# EAGLE design Meshtastic-DIY (EAGLE 9.6.2)
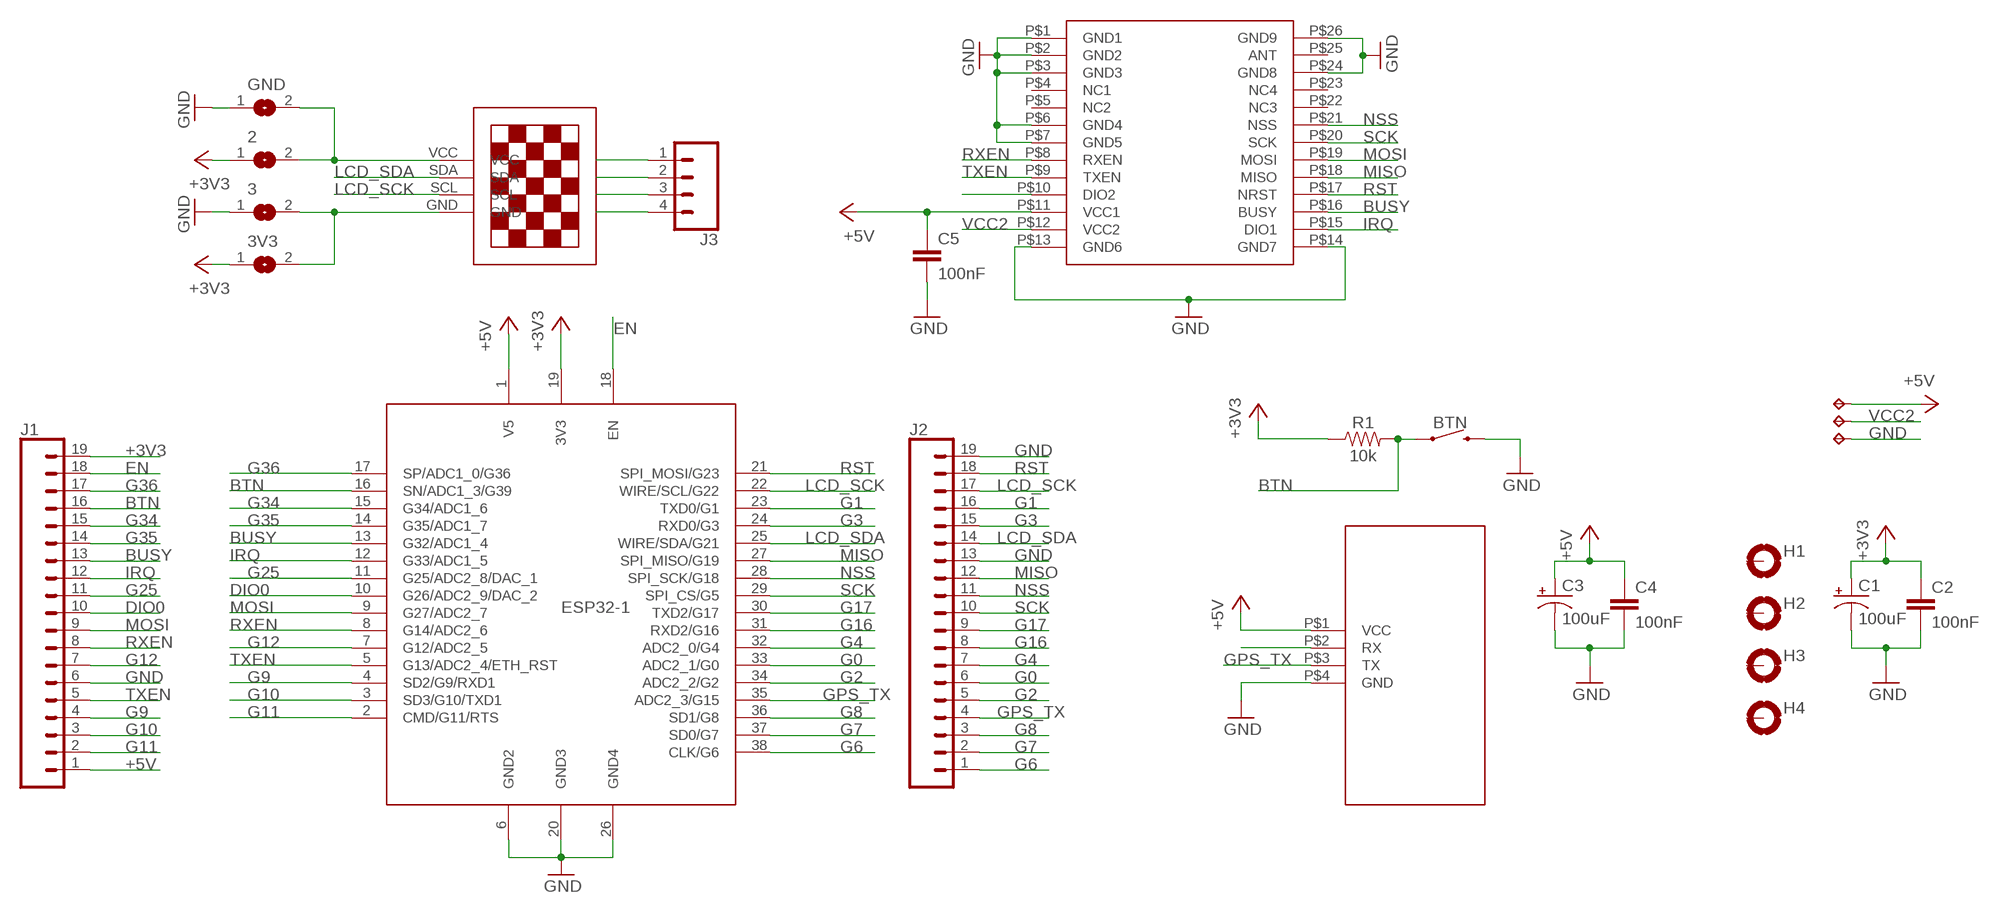
[diagram p0: schematic, sheet 1]

## Parts
2  SJ  [SJ]
3  SJ  [SJ]
3V3  SJ  [SJ]
BTN  MOMENTARY-SWITCH-SPST-PTH-6.0MM  [TACTILE_SWITCH_PTH_6.0MM]
C1  100uF  100UF-POLAR-EIA7343-10V-10%(TANT)  [EIA7343]
C2  100nF  0.33UF/330NF-0805-50V-10%  [0805]
C3  100uF  100UF-POLAR-EIA7343-10V-10%(TANT)  [EIA7343]
C4  100nF  0.33UF/330NF-0805-50V-10%  [0805]
C5  100nF  0.33UF/330NF-0805-50V-10%  [0805]
ESP32-1  NODEMCU_ESP32_WROOM_32  [NODEMCU_ESP32_WROOM_32--38PINS]
GND  SJ  [SJ]
H1  MOUNT-PAD-ROUND3.2  [3,2-PAD]
H2  MOUNT-PAD-ROUND3.2  [3,2-PAD]
H3  MOUNT-PAD-ROUND3.2  [3,2-PAD]
H4  MOUNT-PAD-ROUND3.2  [3,2-PAD]
J1  CONN_191X19_NO_SILK  [1X19_NO_SILK]
J2  CONN_191X19_NO_SILK  [1X19_NO_SILK]
J3  CONN_041X04_NO_SILK  [1X04_NO_SILK]
R1  10k  0.1OHM-1210-1/2W-1%  [1210]
TP1  TPTP14SQ  [TP14SQ]
TP2  TPTP14SQ  [TP14SQ]
TP3  TPTP14SQ  [TP14SQ]
U$1  13"OLED13"OLED  [1.3"OLED]
U$2  E22-XXXMXXS  [E22-XXXMXXS]
U$3  GPS-NEO  [GPS-NEO]

## Nets
+3V3: 2.1 3V3.1 C1.A(+) C2.1 ESP32-1.19(3V3) J1.19 R1.1
+5V: C3.A(+) C4.1 C5.1 ESP32-1.1(V5) J1.1 TP1.TP U$2.P$11(VCC1) U$3.P$1(VCC)
BTN: BTN.1 ESP32-1.16(SN/ADC1_3/G39) J1.16 R1.2
BUSY: ESP32-1.13(G32/ADC1_4) J1.13 U$2.P$16(BUSY)
DIO0: ESP32-1.10(G26/ADC2_9/DAC_2) J1.10
EN: ESP32-1.18(EN) J1.18
G0: ESP32-1.33(ADC2_1/G0) J2.6
G1: ESP32-1.23(TXD0/G1) J2.16
G2: ESP32-1.34(ADC2_2/G2) J2.5
G3: ESP32-1.24(RXD0/G3) J2.15
G4: ESP32-1.32(ADC2_0/G4) J2.7
G6: ESP32-1.38(CLK/G6) J2.1
G7: ESP32-1.37(SD0/G7) J2.2
G8: ESP32-1.36(SD1/G8) J2.3
G9: ESP32-1.4(SD2/G9/RXD1) J1.4
G10: ESP32-1.3(SD3/G10/TXD1) J1.3
G11: ESP32-1.2(CMD/G11/RTS) J1.2
G12: ESP32-1.7(G12/ADC2_5) J1.7
G16: ESP32-1.31(RXD2/G16) J2.8
G17: ESP32-1.30(TXD2/G17) J2.9
G25: ESP32-1.11(G25/ADC2_8/DAC_1) J1.11
G34: ESP32-1.15(G34/ADC1_6) J1.15
G35: ESP32-1.14(G35/ADC1_7) J1.14
G36: ESP32-1.17(SP/ADC1_0/G36) J1.17
GND: 3.1 BTN.3 C1.C(-) C2.2 C3.C(-) C4.2 C5.2 ESP32-1.6(GND2) ESP32-1.20(GND3) ESP32-1.26(GND4) GND.1 J1.6 J2.13 J2.19 TP3.TP U$2.P$1(GND1) U$2.P$2(GND2) U$2.P$3(GND3) U$2.P$6(GND4) U$2.P$7(GND5) U$2.P$13(GND6) U$2.P$14(GND7) U$2.P$24(GND8) U$2.P$26(GND9) U$3.P$4(GND)
GPS_TX: ESP32-1.35(ADC2_3/G15) J2.4 U$3.P$3(TX)
IRQ: ESP32-1.12(G33/ADC1_5) J1.12 U$2.P$15(DIO1)
LCD_SCK: ESP32-1.22(WIRE/SCL/G22) J2.17 J3.3 U$1.SCL
LCD_SDA: ESP32-1.25(WIRE/SDA/G21) J2.14 J3.4 U$1.SDA
MISO: ESP32-1.27(SPI_MISO/G19) J2.12 U$2.P$18(MISO)
MOSI: ESP32-1.9(G27/ADC2_7) J1.9 U$2.P$19(MOSI)
N$1: U$2.P$10(DIO2)
N$2: 3.2 3V3.2 J3.2 U$1.GND
N$3: U$3.P$2(RX)
N$4: 2.2 GND.2 J3.1 U$1.VCC
NSS: ESP32-1.28(SPI_SCK/G18) J2.11 U$2.P$21(NSS)
RST: ESP32-1.21(SPI_MOSI/G23) J2.18 U$2.P$17(NRST)
RXEN: ESP32-1.8(G14/ADC2_6) J1.8 U$2.P$8(RXEN)
SCK: ESP32-1.29(SPI_CS/G5) J2.10 U$2.P$20(SCK)
TXEN: ESP32-1.5(G13/ADC2_4/ETH_RST) J1.5 U$2.P$9(TXEN)
VCC2: TP2.TP U$2.P$12(VCC2)
Unconnected: H1.B3,2(MOUNT) H2.B3,2(MOUNT) H3.B3,2(MOUNT) H4.B3,2(MOUNT) U$2.P$4(NC1) U$2.P$5(NC2) U$2.P$22(NC3) U$2.P$23(NC4) U$2.P$25(ANT)

## Library data of the parts
2 3 3V3 GND = jumper:SJ: SMD solder JUMPER
BTN = SparkFun-Switches:MOMENTARY-SWITCH-SPST: Momentary Switch (Pushbutton) - SPST Normally-open (NO) SPST momentary switches (buttons, pushbuttons). Variants PTH-12MM - 12mm square, through-hole Momentary Pushbutton Switch - 12mm Square <https://www.sparkfun.com/products/9190> (COM-09190) PTH-6.0MM, PTH-6.0MM-KIT - 6.0mm square, through-hole Mini Pushbutton Switch <https://www.sparkfun.com/products/97> (COM-00097) KIT package intended for soldering kit's - only one side of pads' copper is exposed. PTH-RIGHT-ANGLE-KIT - Right-angle, through-hole Right Angle Tactile Button <https://www.sparkfun.com/products/10791> - Used on SparkFun BigTime Watch Kit <https://www.sparkfun.com/products/11734> SMD-12MM - 12mm square, surface-mount Tactile Button - SMD (12mm) <https://www.sparkfun.com/products/12993> (COM-12993) Used on SparkFun PicoBoard <https://www.sparkfun.com/products/11888> SMD-4.5MM - 4.5mm Square Trackball Switch Used on SparkFun Blackberry Trackballer Breakout <https://www.sparkfun.com/products/13169> SMD-4.6MMX2.8MM - 4.60mm x 2.80mm, surface mount Used on SparkFun SAMD21 Mini Breakout <https://www.sparkfun.com/products/13664> SMD-5.2MM, SMD-5.2-REDUNDANT - 5.2mm square, surface-mount Mini Pushbutton Switch - SMD <https://www.sparkfun.com/products/8720> (COM-08720) Used on Arduino Pro Mini <https://www.sparkfun.com/products/11114> REDUNDANT package connects both switch circuits together SMD-6.0X3.5MM - 6.0 x 3.5mm, surface mount Momentary Reset Switch SMD <https://www.sparkfun.com/products/8229> (COM-08229) SMD-6.2MM-TALL - 6.2mm square, surface mount Tactile Button - SMD (6mm) <https://www.sparkfun.com/products/12992> Used on SparkFun Digital Sandbox <https://www.sparkfun.com/products/12651> SMD-RIGHT-ANGLE - Right-angle, surface mount Used on SparkFun Block for Intel® Edison - Arduino <https://www.sparkfun.com/products/13036>; PROD_ID: SWCH-08441; SF_SKU: COM-00097
C1 C3 = SparkFun-Capacitors:100UF-POLAR: 100µF polarized capacitors A capacitor is a passive two-terminal electrical component used to store electrical energy temporarily in an electric field.; PROD_ID: CAP-07890
C2 C4 C5 = SparkFun-Capacitors:0.33UF/330NF: 0.33µF/330nF ceramic capacitors A capacitor is a passive two-terminal electrical component used to store electrical energy temporarily in an electric field.; PROD_ID: CAP-08469; VALUE: 0.33µF
ESP32-1 = ESP32 NODEMCU WROOM 32:NODEMCU_ESP32_WROOM_32: NODEMCU ESP32 WROOM 32 38 Pins PINOUT: https://cdn.shopify.com/s/files/1/1509/1638/files/ESP_-_32_NodeMCU_Developmentboard_Pinout_Diagram.jpg?4479111012146266271; ESP: ESP32 WROOM 32
H1-H4 = holes:MOUNT-PAD-ROUND: MOUNTING PAD, round
J1 J2 = SparkFun-SEWPAD16:CONN_19: Multi connection point. Often used as Generic Header-pin footprint for 0.1 inch spaced/style header connections On any of the 0.1 inch spaced packages, you can populate with these: Break Away Headers - Straight <https://www.sparkfun.com/products/116> (PRT-00116) Break Away Male Headers - Right Angle <https://www.sparkfun.com/products/553> (PRT-00553) Female Headers <https://www.sparkfun.com/products/115> (PRT-00115) Break Away Headers - Machine Pin <https://www.sparkfun.com/products/117> (PRT-00117) Break Away Female Headers - Swiss Machine Pin <https://www.sparkfun.com/products/743> (PRT-00743) For SCREWTERMINALS and SPRING TERMINALS visit here: Screw Terimnals on SparkFun.com <https://www.sparkfun.com/search/results?term=Screw+Terminals> (5mm/3.5mm/2.54mm spacing) This device is also useful as a general connection point to wire up your design to another part of your project. Our various solder wires solder well into these plated through hole pads. Hook-Up Wire - Assortment (Stranded, 22 AWG) <https://www.sparkfun.com/products/11375> (PRT-11375) Hook-Up Wire - Assortment (Solid Core, 22 AWG) <https://www.sparkfun.com/products/11367> (PRT-11367) View the entire wire category on our website here <https://www.sparkfun.com/categories/141> Special notes: Molex polarized connector foot print use with SKU : PRT-08231 with associated crimp pins and housings. 1MM SMD Version SKU: PRT-10208 NOTES ON THE VARIANTS LOCK and LOCK_LONGPADS... This footprint was designed to help hold the alignment of a through-hole component (i.e. 6-pin header) while soldering it into place. You may notice that each hole has been shifted either up or down by 0.005 of an inch from it's more standard position (which is a perfectly straight line). This slight alteration caused the pins (the squares in the middle) to touch the edges of the holes. Because they are alternating, it causes a "brace" to hold the component in place. 0.005 has proven to be the perfect amount of "off-center" position when using our standard breakaway headers. Although looks a little odd when you look at the bare footprint, once you have a header in there, the alteration is very hard to notice. Also,if you push a header all the way into place, it is covered up entirely on the bottom side.
J3 = SparkFun-Connectors:CONN_04: Multi connection point. Often used as Generic Header-pin footprint for 0.1 inch spaced/style header connections On any of the 0.1 inch spaced packages, you can populate with these: Break Away Headers - Straight <https://www.sparkfun.com/products/116> (PRT-00116) Break Away Male Headers - Right Angle <https://www.sparkfun.com/products/553> (PRT-00553) Female Headers <https://www.sparkfun.com/products/115> (PRT-00115) Break Away Headers - Machine Pin <https://www.sparkfun.com/products/117> (PRT-00117) Break Away Female Headers - Swiss Machine Pin <https://www.sparkfun.com/products/743> (PRT-00743) For SCREWTERMINALS and SPRING TERMINALS visit here: Screw Terimnals on SparkFun.com <https://www.sparkfun.com/search/results?term=Screw+Terminals> (5mm/3.5mm/2.54mm spacing) This device is also useful as a general connection point to wire up your design to another part of your project. Our various solder wires solder well into these plated through hole pads. Hook-Up Wire - Assortment (Stranded, 22 AWG) <https://www.sparkfun.com/products/11375> (PRT-11375) Hook-Up Wire - Assortment (Solid Core, 22 AWG) <https://www.sparkfun.com/products/11367> (PRT-11367) View the entire wire category on our website here <https://www.sparkfun.com/categories/141> Special notes: Molex polarized connector foot print use with SKU : PRT-08231 with associated crimp pins and housings. 1MM SMD Version SKU: PRT-10208; PROD_ID: CONN-09696
R1 = SparkFun-Resistors:0.1OHM: 0.1Ω resistor A resistor is a passive two-terminal electrical component that implements electrical resistance as a circuit element. Resistors act to reduce current flow, and, at the same time, act to lower voltage levels within circuits. - Wikipedia; PROD_ID: RES-12374; VALUE: 0.1
TP1-TP3 = testpad:TP: Test pad
U$1 = 13oled:13"OLED
U$2 = E22-XXXMXXS:E22-XXXMXXS
U$3 = 13oled:GPS-NEO

## Board
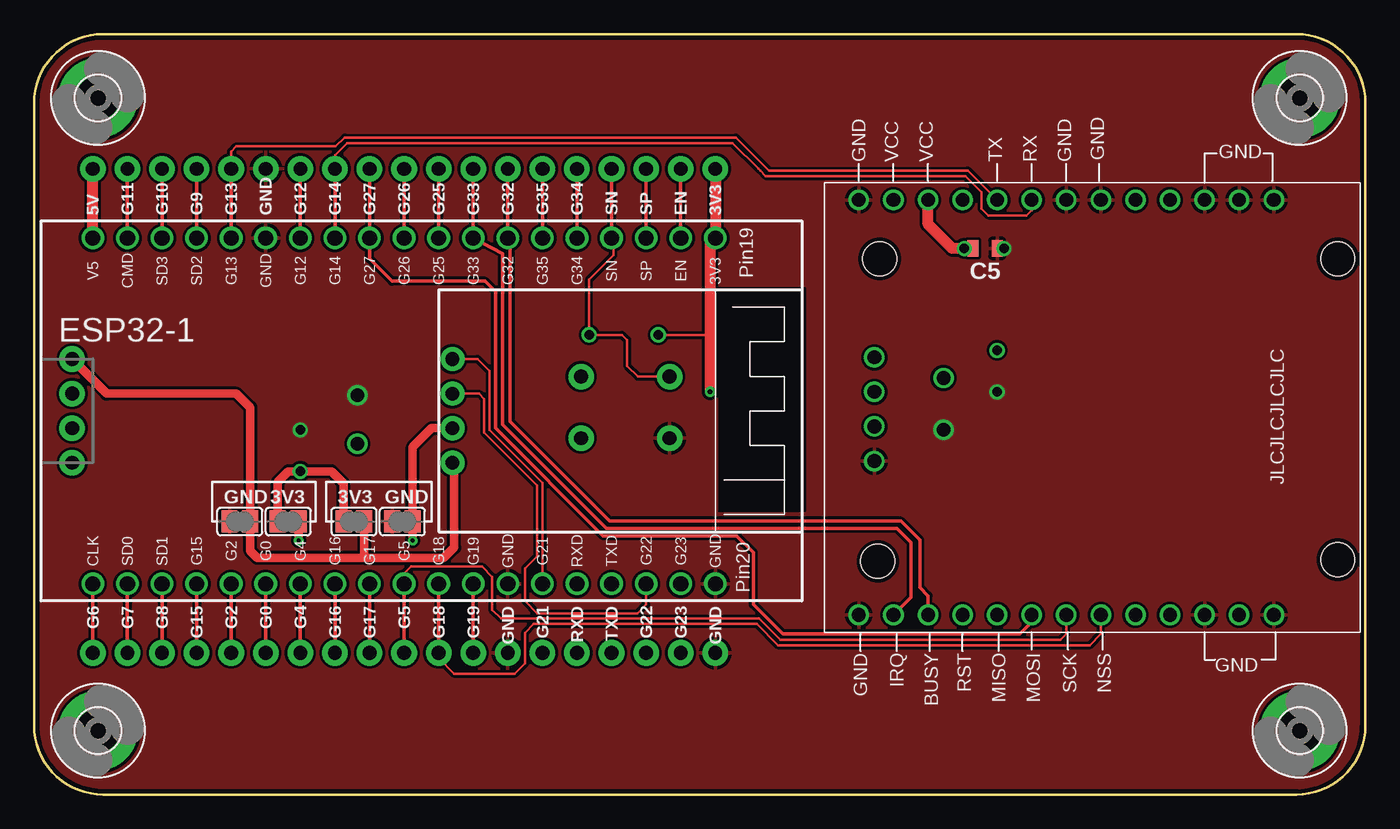
[diagram p1: board, top side]
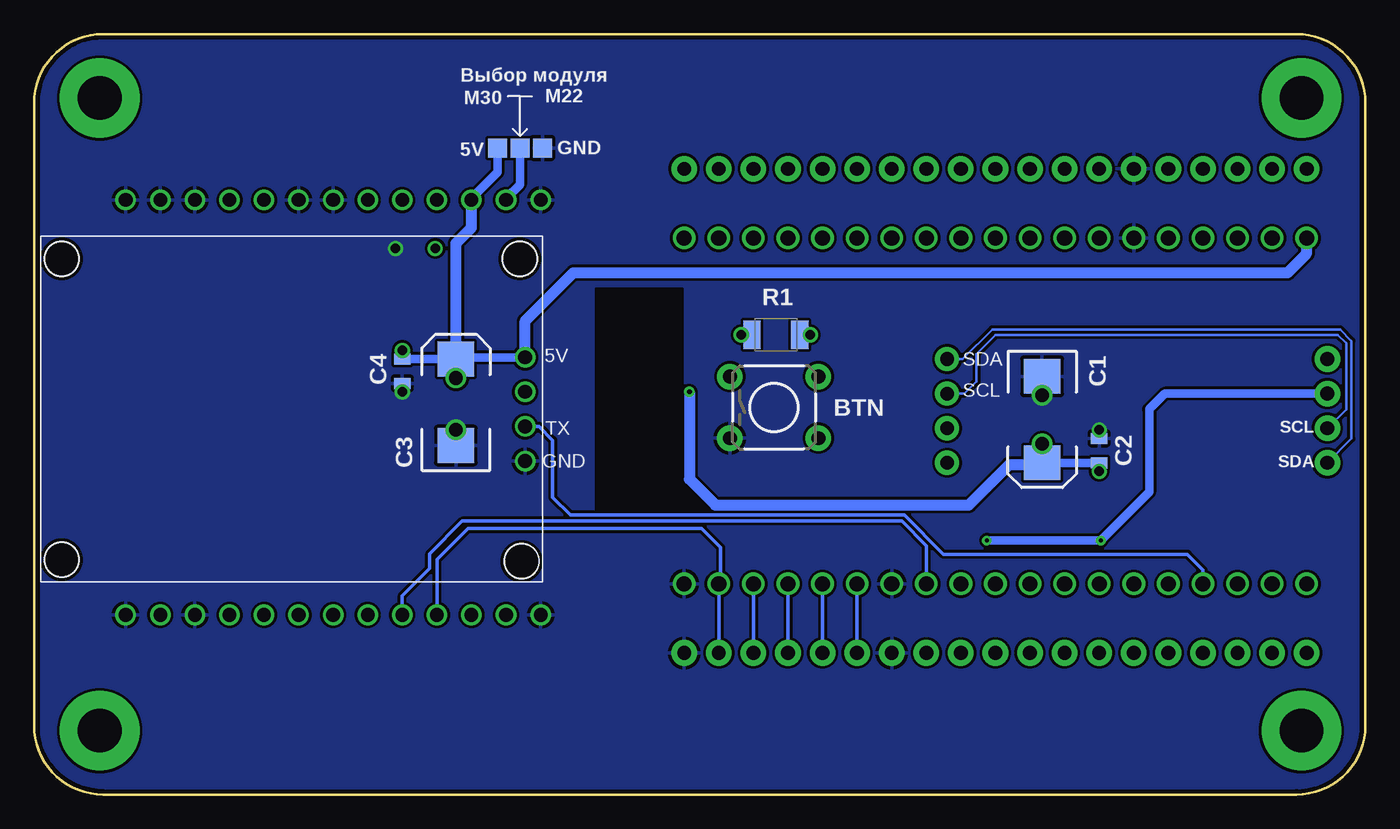
[diagram p2: board, bottom side, seen from below]

Size 97.79 x 55.88 mm. Coordinates in mm from the lower left corner, seen from the top.
Outline: 97.79,5.08 97.79,50.8 arc90 92.71,55.88 5.08,55.88 arc90 0,50.8 0,5.08 arc90 5.08,0 92.71,0 arc90 97.79,5.08
Outline: 97.79,5.08 97.79,4.7
Copper layers (1*16): Top 0.035mm / dielectric 1.5mm / Bottom 0.035mm
Design rules "default *": minimum track width 0.2mm, minimum drill 0.25mm, track to track 0.2mm, track to pad 0.2mm, pad to pad 0.2mm, via to via 0.2mm, smd to smd 6mil, copper to edge 0.3mm, drill to drill 0.3mm, minimum pad ring 10mil, minimum via ring 8mil, stop-mask expansion 2mil, vias tented up to drill 0.35mm, thermal gap 10mil
Holes 2.5 mm at 62.1,39.37 61.98,17.14 95.76,39.37 95.76,17.27
tRestrict: area 50.3,20.8 to 56.6,37.2
bRestrict: area 50.2,20.8 to 56.5,37.2

### Footprints (pad centres in the part's own frame; a part is rotated, then mirrored left to right if it is on the bottom)
SJ = smd 1.168 x 1.6: 1 -0.762,0; 2 0.762,0
TACTILE_SWITCH_PTH_6.0MM = drill 1.016 pad 1.88: 1 -3.251,2.261; 2 3.251,2.261; 3 -3.251,-2.261; 4 3.251,-2.261
EIA7343 = smd 2.55 x 2.7: A 3.17,0; C -3.17,0
0805 = smd 0.8 x 1.2: 1 -0.9,0; 2 0.9,0
NODEMCU_ESP32_WROOM_32--38PINS = drill 1.11 pad 1.6: 1 -12.7,-24.13; 2 -12.7,-21.59; 3 -12.7,-19.05; 4 -12.7,-16.51; 5 -12.7,-13.97; 6 -12.7,-11.43; 7 -12.7,-8.89; 8 -12.7,-6.35; 9 -12.7,-3.81; 10 -12.7,-1.27; 11 -12.7,1.27; 12 -12.7,3.81; 13 -12.7,6.35; 14 -12.7,8.89; 15 -12.7,11.43; 16 -12.7,13.97; 17 -12.7,16.51; 18 -12.7,19.05; 19 -12.7,21.59; 20 12.7,21.59; 21 12.7,19.05; 22 12.7,16.51; 23 12.7,13.97; 24 12.7,11.43; 25 12.7,8.89; 26 12.7,6.35; 27 12.7,3.81; 28 12.7,1.27; 29 12.7,-1.27; 30 12.7,-3.81; 31 12.7,-6.35; 32 12.7,-8.89; 33 12.7,-11.43; 34 12.7,-13.97; 35 12.7,-16.51; 36 12.7,-19.05; 37 12.7,-21.59; 38 12.7,-24.13
3,2-PAD = drill 3.2 pad 5.842: B3,2 0,0
1X19_NO_SILK = drill 1.016 pad 1.88: 1 0,0; 2 2.54,0; 3 5.08,0; 4 7.62,0; 5 10.16,0; 6 12.7,0; 7 15.24,0; 8 17.78,0; 9 20.32,0; 10 22.86,0; 11 25.4,0; 12 27.94,0; 13 30.48,0; 14 33.02,0; 15 35.56,0; 16 38.1,0; 17 40.64,0; 18 43.18,0; 19 45.72,0
1X04_NO_SILK = drill 1.016 pad 1.88: 1 0,0; 2 2.54,0; 3 5.08,0; 4 7.62,0
1210 = smd 1.27 x 2.06: 1 -1.755,0; 2 1.755,0
TP14SQ = smd 1.4 x 1.4: TP 0,0
1.3"OLED = drill 1 pad 1.778: GND 2.54,0; SCL 5.08,0; SDA 7.62,0; VCC 0,0
E22-XXXMXXS = drill 1: P$1 -15.24,13.97; P$2 -15.24,11.43; P$3 -15.24,8.89; P$4 -15.24,6.35; P$5 -15.24,3.81; P$6 -15.24,1.27; P$7 -15.24,-1.27; P$8 -15.24,-3.81; P$9 -15.24,-6.35; P$10 -15.24,-8.89; P$11 -15.24,-11.43; P$12 -15.24,-13.97; P$13 -15.24,-16.51; P$14 15.24,-16.51; P$15 15.24,-13.97; P$16 15.24,-11.43; P$17 15.24,-8.89; P$18 15.24,-6.35; P$19 15.24,-3.81; P$20 15.24,-1.27; P$21 15.24,1.27; P$22 15.24,3.81; P$23 15.24,6.35; P$24 15.24,8.89; P$25 15.24,11.43; P$26 15.24,13.97
GPS-NEO = drill 1: P$1 -3.81,16.51; P$2 -1.27,16.51; P$3 1.27,16.51; P$4 3.81,16.51

### Placement (x,y rotation side)
2  23.5,20.07 0 top
3  27.05,20.07 0 top
3V3  18.67,20.07 0 top
BTN  43.43,28.45 0 bottom
C1  23.75,27.56 270 bottom
C2  19.56,25.27 90 bottom
C3  66.8,28.83 90 bottom
C4  70.74,31.11 270 bottom
C5  69.85,40.13 0 top
ESP32-1  28.45,28.19 270 top
GND  15.11,20.07 0 top
H1  4.7,51.18 0 top
H2  92.96,51.18 0 top
H3  4.7,4.7 0 top
H4  92.96,4.7 0 top
J1  4.32,45.97 0 top
J2  4.32,10.41 0 top
J3  2.79,32 270 top
R1  43.31,33.78 0 bottom
TP1  63.75,47.5 0 bottom
TP2  62.1,47.5 0 bottom
TP3  60.45,47.5 0 bottom
U$1  30.73,24.38 90 bottom
U$2  77.09,28.45 270 top
U$3  78.23,28.32 270 bottom

### Tracks (layer width: path | path; a pad name or v marks a point on that pad's centre or on a via)
3V3  (via drill 1)
  other vias: 23.75,25.78
+3V3  (via drill 0.35, 0.7)
  Top 0.2: v45.85,33.78 49.53,33.78 49.66,33.91
  Top 0.61: 2.1 22.73,22.86 21.84,23.75 v19.56,23.75 18.67,23.75 17.91,22.99 3V3.1
  Top 0.813: v49.66,29.59 49.66,33.91 49.66,40.98 ESP32-1.19 J1.19
  Bottom 0.2: v19.56,23.75 C2.1
  Bottom 0.254: R1.1 v45.85,33.78
  Bottom 0.61: C2.1 23.76,24.37 24.13,24 24.13,24.01 24.07,24.07 C1.A
  Bottom 0.813: 24.07,24.07 24.26,24.26 26.16,24.26 29.14,21.28 47.75,21.28 49.66,23.18 v49.66,29.59
+5V  (via drill 0.7, 1)
  Top 0.813: C5.1 v68.33,40.13 67.44,40.13 65.66,41.91 U$2.P$11 | ESP32-1.1 J1.1
  Bottom 0.2: C3.A v66.8,30.61 | v70.74,32.64 C4.1
  Bottom 0.61: U$3.P$1 66.67,32.13 C3.A 70.72,32 C4.1 | TP1.TP 63.75,45.72 65.66,43.81 U$2.P$11
  Bottom 0.813: U$3.P$1 61.72,34.8 58.17,38.35 5.71,38.35 4.32,39.75 ESP32-1.1 | C3.A 66.8,40.51 65.66,41.66 U$2.P$11
BTN  (via drill 0.7)
  Top 0.2: ESP32-1.16 42.55,40.93 42.55,39.62 40.77,37.85 v40.77,33.78 43.18,33.78 43.56,33.4 43.56,31.5 44.35,30.71 BTN.1
  Top 0.254: J1.16 ESP32-1.16
  Bottom 0.254: R1.2 v40.77,33.78
BUSY
  Top 0.254: U$2.P$16 65.66,14.61 65.05,15.21 65.05,18.71 63.67,20.09 42.27,20.09 34.95,27.41 34.95,40.94 ESP32-1.13 J1.13
DIO0
  Top 0.254: J1.10 ESP32-1.10
EN
  Top 0.254: J1.18 ESP32-1.18
G0
  Top 0.254: ESP32-1.33 J2.6
G1
  Bottom 0.254: ESP32-1.23 J2.16
G2
  Top 0.254: ESP32-1.34 J2.5
G3
  Bottom 0.254: ESP32-1.24 J2.15
G4
  Top 0.254: ESP32-1.32 J2.7
G6
  Top 0.254: ESP32-1.38 J2.1
G7
  Top 0.254: ESP32-1.37 J2.2
G8
  Top 0.254: ESP32-1.36 J2.3
G9
  Top 0.254: J1.4 ESP32-1.4
G10
  Top 0.254: J1.3 ESP32-1.3
G11
  Top 0.254: ESP32-1.2 J1.2
G12
  Top 0.254: J1.7 ESP32-1.7
G16
  Top 0.254: ESP32-1.31 J2.8
G17
  Top 0.254: ESP32-1.30 J2.9
G25
  Top 0.254: J1.11 ESP32-1.11
G34
  Top 0.254: J1.15 ESP32-1.15
G35
  Top 0.254: J1.14 ESP32-1.14
G36
  Top 0.254: J1.17 ESP32-1.17
GND  (via drill 0.7, 1)
  Top 0.813: C5.2 v71.25,40.13
  Bottom 0.2: C1.C v23.75,29.34 | v19.56,26.8 C2.2 | v70.74,29.59 C4.2
  other vias: 66.8,26.8
  pour Top: -0.38,56.39 -0.38,-0.51 98.3,-0.51 98.3,56.39
  pour Bottom: -0.76,56.64 -0.76,-0.25 98.04,-0.25 98.04,56.64
GPS_TX
  Top 0.254: ESP32-1.35 J2.4
  Bottom 0.254: U$3.P$3 60.71,27.05 59.69,26.04 59.69,21.84 58.39,20.55 33.87,20.55 30.98,17.65 13.08,17.65 11.94,16.51 ESP32-1.35
IRQ
  Top 0.254: U$2.P$15 64.39,14.48 64.39,18.54 63.37,19.56 42.04,19.56 34.42,27.18 34.42,39.73 ESP32-1.12 J1.12
LCD_SCK
  Top 0.2: U$1.SCL 32.68,29.46 33.06,29.08 33.06,26.61 36.94,22.73 36.94,17.51 36.07,16.64 36.07,14.22 36.96,13.34 44.32,13.34 44.96,13.97 ESP32-1.22
  Bottom 0.2: J3.3 1.43,28.29 1.43,33.18 2.03,33.78 27.18,33.78 28.57,32.38 28.57,30.35 29.46,29.46 U$1.SCL
  Bottom 0.254: ESP32-1.22 J2.17
LCD_SDA
  Top 0.2: U$1.SDA 32.57,32 33.46,31.11 33.46,26.77 37.34,22.89 ESP32-1.25
  Bottom 0.2: J3.4 1.03,26.15 1.03,33.34 1.87,34.18 27.41,34.18 29.59,32 U$1.SDA
  Bottom 0.254: ESP32-1.25 J2.14
MISO
  Top 0.254: ESP32-1.27 J2.12
  Bottom 0.254: U$2.P$18 70.74,14.61 68.73,16.61 68.73,17.69 66.33,20.09 34.06,20.09 32.26,18.29 ESP32-1.27
MOSI
  Top 0.254: U$2.P$19 73.28,12.7 72.39,11.81 54.99,11.81 52.83,13.97 52.83,17.78 51.59,19.02 41.81,19.02 33.88,26.95 33.88,36.96 33.12,37.72 26.29,37.72 24.64,39.37 ESP32-1.9 J1.9
N$2  (via drill 0.3)
  Top 0.61: U$1.GND 29.21,26.92 27.81,25.53 3.2 v27.81,18.67 | 3V3.2 v19.43,18.67
  Bottom 0.61: v27.81,18.67 v19.43,18.67 15.88,22.23 15.88,28.32 14.73,29.46 J3.2
N$4
  Top 0.61: 24.26,17.4 30.1,17.4 30.86,18.16 30.86,24.26 U$1.VCC | 24.26,17.4 16.38,17.4 15.88,17.91 GND.2 15.88,28.45 14.86,29.46 5.33,29.46 J3.1 | 2.2 24.26,17.4
NSS
  Top 0.2: J2.11 29.72,10.03 30.86,8.89 35.31,8.89 36.07,9.65 36.07,11.9 36.7,12.54 53.1,12.54 54.65,10.98 77.53,10.98 78.36,11.81 U$2.P$21
  Top 0.254: ESP32-1.28 J2.11
RST
  Bottom 0.254: U$2.P$17 68.2,17.27 65.91,19.56 48.77,19.56 47.37,18.16 47.37,15.54 ESP32-1.21 J2.18
RXEN
  Top 0.2: 22.1,45.85 22.1,46.99 22.99,47.88 51.31,47.88 53.21,45.97 53.34,45.85 53.74,45.45 68.41,45.45 69.6,44.27 69.6,43.05 70.1,42.55 72.9,42.55 73.28,42.93 U$2.P$8
  Top 0.254: J1.8 22.1,45.85 ESP32-1.8
SCK
  Top 0.2: ESP32-1.29 27.18,16.26 27.69,16.76 32.89,16.76 33.66,16 33.66,13.59 34.31,12.94 53.26,12.94 54.81,11.38 75.39,11.38 75.82,11.81 U$2.P$20
  Top 0.254: ESP32-1.29 J2.10
TXEN
  Top 0.2: J1.5 14.48,47.24 14.86,47.62 22.17,47.62 22.82,48.28 51.54,48.28 53.98,45.85 68.58,45.85 U$2.P$9
  Top 0.254: J1.5 ESP32-1.5
VCC2
  Bottom 0.61: TP2.TP 62.1,44.83 63.12,43.81 U$2.P$12

### Text on the board
tNames: GND | GND | GND | VCC | VCC | TX | RX | GND | 5V | G11 | G10 | G9 | G13 | GND | G12 | G14 | G27 | G26 | G25 | G33 | G32 | G35 | G34 | SN | SP | EN | 3V3 | JLCJLCJLCJLC | GND | 3V3 | 3V3 | GND | G6 | G7 | G8 | G15 | G2 | G0 | G4 | G16 | G17 | G5 | G18 | G19 | GND | G21 | RXD | TXD | G22 | G23 | GND | GND | IRQ | BUSY | RST | MISO | MOSI | SCK | NSS | GND
bNames: Выбор модуля | M22 | M30 | GND | 5V | 5V | SDA | SCL | SCL | TX | GND | SDA